# Altium schematic sheet sheet_display.SchDoc
size A4
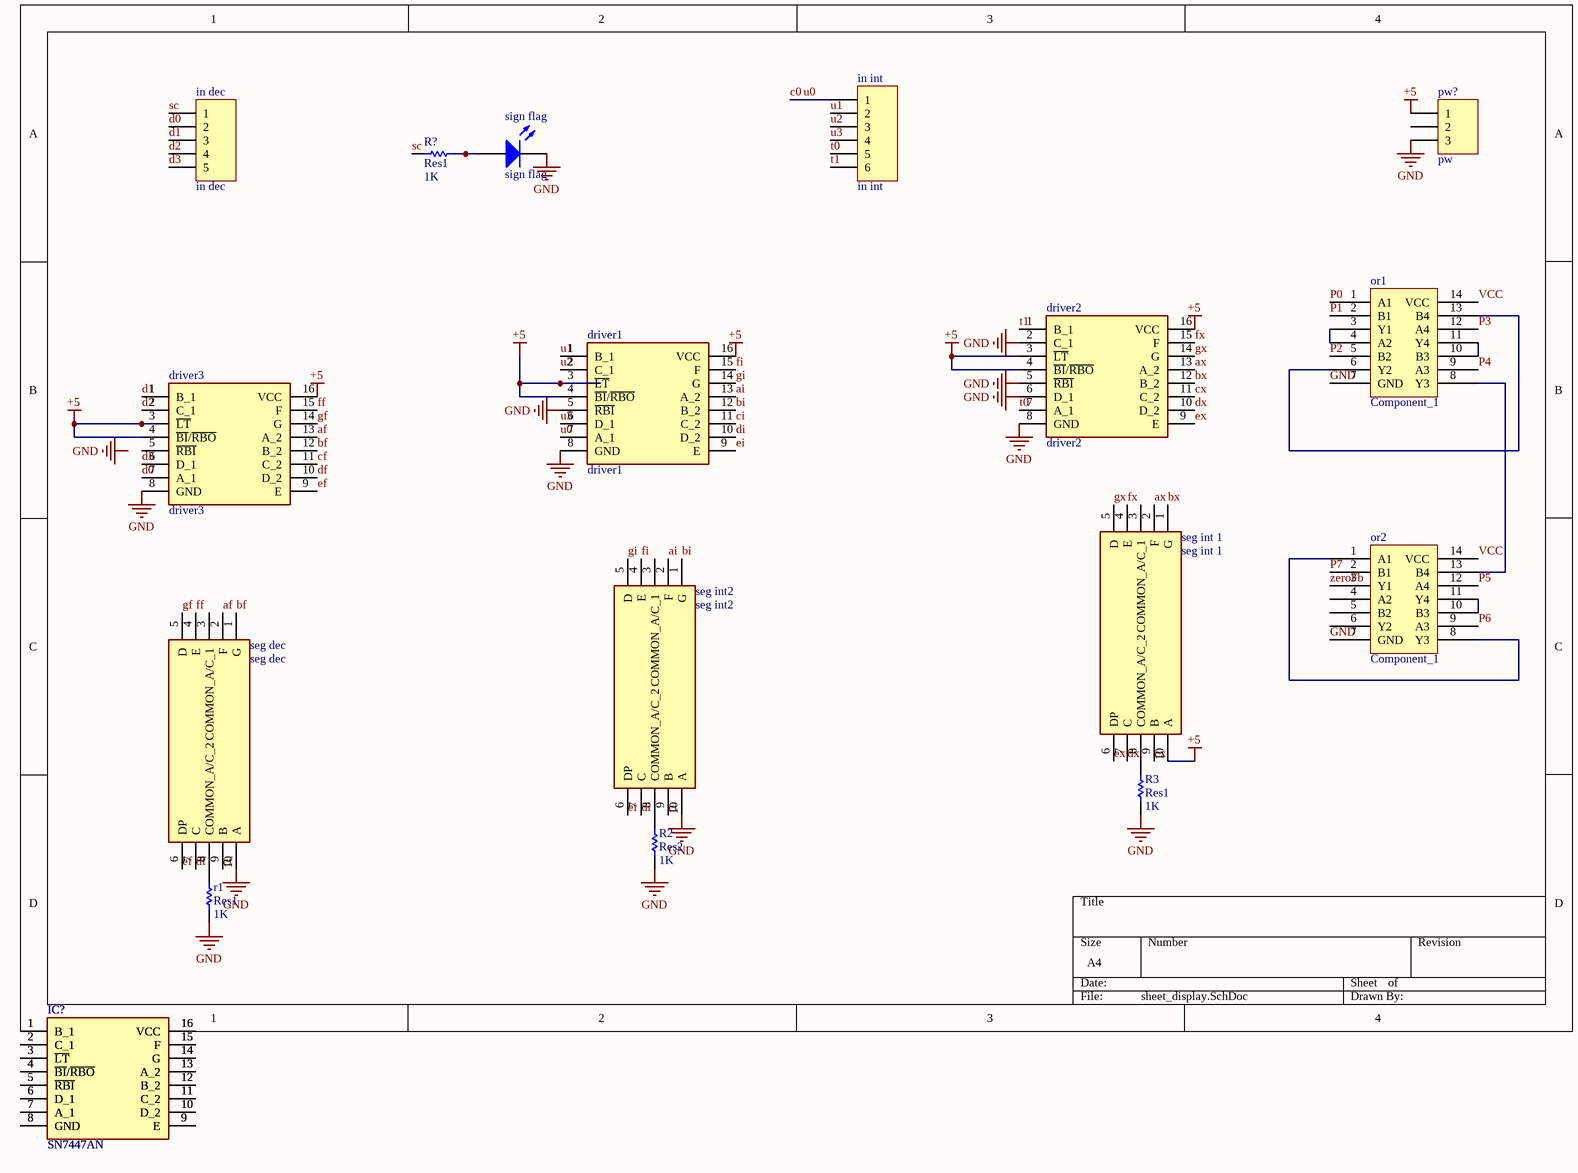
[diagram p0: sheet_display.SchDoc]

## Parts
(Parts that share a designator on the sheet are numbered #1, #2 ... from top to bottom, then left to right.)
driver1  driver1  [Model Name]
driver2  driver2  [DIP762W66P254L2134H508Q16N]
driver3  driver3  [DIP762W66P254L2134H508Q16N]
IC?#1  SN7447AN  [DIP762W66P254L2134H508Q16N]
IC?#2  SN7447AN  [DIP762W66P254L2134H508Q16N]
IC?#3  SN7447AN  [DIP762W66P254L2134H508Q16N]
in_dec  in dec  [HDR1X5]
in_int  in int  [HDR1X6]
or1  Component_1  [PCBComponent_1]
or2  Component_1  [PCBComponent_1]
pw?  pw  [HDR1X3]
r1  Res1  value 1K  [AXIAL-0.3]
R2  Res2  value 1K  [AXIAL-0.3]
R3  Res1  value 1K  [AXIAL-0.3]
R?  Res1  value 1K  [AXIAL-0.3]
seg_dec  seg dec  [DIPS762W60P254L1280H725Q10N]
seg_int2  seg int2  [DIPS762W60P254L1280H725Q10N]
seg_int_1  seg int 1  [DIPS762W60P254L1280H725Q10N]
sign_flag  sign flag  [3.2X1.6X1.1]

## Nets
+5: driver1.3(~{LT}) driver1.4(~{BI}/~{RBO}) driver1.16(VCC) driver2.3(~{LT}) driver2.4(~{BI}/~{RBO}) driver2.16(VCC) driver3.3(~{LT}) driver3.4(~{BI}/~{RBO}) driver3.16(VCC) pw?.1 seg_int_1.10(A)
GND: driver1.5(~{RBI}) driver1.8(GND) driver2.2(C_1) driver2.5(~{RBI}) driver2.6(D_1) driver2.8(GND) driver3.8(GND) or1.7(GND) or2.7(GND) pw?.3 r1.1 R2.1 R3.1 seg_dec.10(A) seg_int2.10(A) sign_flag.2(K)
af: driver3.13(A_2) seg_dec.2(F)
ai: driver1.13(A_2) seg_int2.2(F)
ax: driver2.13(A_2) seg_int_1.2(F)
bf: driver3.12(B_2) seg_dec.1(G)
bi: driver1.12(B_2) seg_int2.1(G)
bx: driver2.12(B_2) seg_int_1.1(G)
c0: driver1.7(A_1) in_int.1  [also labelled u0]
cf: driver3.11(C_2) seg_dec.9(B)
ci: driver1.11(C_2) seg_int2.9(B)
cx: driver2.11(C_2) seg_int_1.9(B)
d0: driver3.7(A_1) in_dec.2
d1: driver3.1(B_1) in_dec.3
d2: driver3.2(C_1) in_dec.4
d3: driver3.6(D_1) in_dec.5
df: driver3.10(D_2) seg_dec.7(C)
di: driver1.10(D_2) seg_int2.7(C)
dx: driver2.10(D_2) seg_int_1.7(C)
ef: driver3.9(E) seg_dec.6(DP)
ei: driver1.9(E) seg_int2.6(DP)
ex: driver2.9(E) seg_int_1.6(DP)
ff: driver3.15(F) seg_dec.4(E)
fi: driver1.15(F) seg_int2.4(E)
fx: driver2.15(F) seg_int_1.4(E)
gf: driver3.14(G) seg_dec.5(D)
gi: driver1.14(G) seg_int2.5(D)
gx: driver2.14(G) seg_int_1.5(D)
P0: or1.1(A1)
P1: or1.2(B1)
P2: or1.5(B2)
P3: or1.12(A4)
P4: or1.9(A3)
P5: or2.12(A4)
P6: or2.9(A3)
P7: or2.2(B1)
sc: in_dec.1 R?.2
t0: driver2.7(A_1) in_int.5
t1: driver2.1(B_1) in_int.6
u1: driver1.1(B_1) in_int.2
u2: driver1.2(C_1) in_int.3
u3: driver1.6(D_1) in_int.4
VCC: or1.14(VCC) or2.14(VCC)
zeroFb: or2.3(Y1)
NetIC?#1_1: IC?#1.1(B_1) IC?#2.1(B_1) IC?#3.1(B_1)
NetIC?#1_2: IC?#1.2(C_1) IC?#2.2(C_1) IC?#3.2(C_1)
NetIC?#1_3: IC?#1.3(~{LT}) IC?#2.3(~{LT}) IC?#3.3(~{LT})
NetIC?#1_4: IC?#1.4(~{BI}/~{RBO}) IC?#2.4(~{BI}/~{RBO}) IC?#3.4(~{BI}/~{RBO})
NetIC?#1_5: IC?#1.5(~{RBI}) IC?#2.5(~{RBI}) IC?#3.5(~{RBI})
NetIC?#1_6: IC?#1.6(D_1) IC?#2.6(D_1) IC?#3.6(D_1)
NetIC?#1_7: IC?#1.7(A_1) IC?#2.7(A_1) IC?#3.7(A_1)
NetIC?#1_8: IC?#1.8(GND) IC?#2.8(GND) IC?#3.8(GND)
NetIC?#1_9: IC?#1.9(E) IC?#2.9(E) IC?#3.9(E)
NetIC?#1_10: IC?#1.10(D_2) IC?#2.10(D_2) IC?#3.10(D_2)
NetIC?#1_11: IC?#1.11(C_2) IC?#2.11(C_2) IC?#3.11(C_2)
NetIC?#1_12: IC?#1.12(B_2) IC?#2.12(B_2) IC?#3.12(B_2)
NetIC?#1_13: IC?#1.13(A_2) IC?#2.13(A_2) IC?#3.13(A_2)
NetIC?#1_14: IC?#1.14(G) IC?#2.14(G) IC?#3.14(G)
NetIC?#1_15: IC?#1.15(F) IC?#2.15(F) IC?#3.15(F)
NetIC?#1_16: IC?#1.16(VCC) IC?#2.16(VCC) IC?#3.16(VCC)
Netor1_3: or1.3(Y1) or1.4(A2)
Netor1_6: or1.6(Y2) or1.13(B4)
Netor1_8: or1.8(Y3) or2.13(B4)
Netor1_10: or1.10(B3) or1.11(Y4)
Netor2_1: or2.1(A1) or2.8(Y3)
Netor2_10: or2.10(B3) or2.11(Y4)
Netr1_2: r1.2 seg_dec.8(COMMON_A/C_2)
NetR2_2: R2.2 seg_int2.8(COMMON_A/C_2)
NetR3_2: R3.2 seg_int_1.8(COMMON_A/C_2)
NetR?_1: R?.1 sign_flag.1(A)

Not connected (* = marked no-connect by the designer): driver3 5(~{RBI}); or2 4(A2) 5(B2) 6(Y2); pw? 2; seg_dec 3(COMMON_A/C_1); seg_int2 3(COMMON_A/C_1); seg_int_1 3(COMMON_A/C_1)

## Notes on the sheet
- Labels drawn without touching a wire or pin: GND

## Library data of the parts
driver1-driver3 IC?#1-IC?#3 = SN7447AN: Integrated Circuit; Manufacturer_Name: Texas Instruments; Datasheet Link: https://componentsearchengine.com/Datasheets/2/SN7447AN.pdf; Height: 5.08mm; Manufacturer_Part_Number: SN7447AN; Mouser Part Number: 595-SN7447AN; Mouser Price/Stock: https://www.mouser.com/Search/Refine.aspx?Keyword=595-SN7447AN; RS Part Number: 0305406P; RS Price/Stock: http://uk.rs-online.com/web/p/products/0305406P
in_dec = Header 5: Header, 5-Pin; LatestRevisionDate: 17-Jul-2002; LatestRevisionNote: Re-released for DXP Platform.; Publisher: Altium Limited
in_int = Header 6: Header, 6-Pin; LatestRevisionDate: 17-Jul-2002; LatestRevisionNote: Re-released for DXP Platform.; Publisher: Altium Limited
pw? = Header 3: Header, 3-Pin; LatestRevisionDate: 17-Jul-2002; LatestRevisionNote: Re-released for DXP Platform.; Publisher: Altium Limited
r1 R2 R3 R? = Res1: Resistor; Published: 8-Jun-2000; LatestRevisionDate: 17-Jul-2002; LatestRevisionNote: Re-released for DXP Platform.; PackageReference: AXIAL-0.3; Publisher: Altium Limited; PackageDescription: Axial Device, Thru-Hole; 2 Leads; 0.3 in Pin Spacing
seg_dec = HDSP-301E: Manufacturer_Name: Avago Technologies; Datasheet Link: https://docs.broadcom.com/docs/AV02-0625EN; Height: 7.25mm; Manufacturer_Part_Number: HDSP-301E; Mouser Part Number: 630-HDSP-301E; Mouser Price/Stock: https://www.mouser.com/Search/Refine.aspx?Keyword=630-HDSP-301E
seg_int2 seg_int_1 = HDSP-301E: seg dec; Manufacturer_Name: Avago Technologies; Datasheet Link: https://docs.broadcom.com/docs/AV02-0625EN; Height: 7.25mm; Manufacturer_Part_Number: HDSP-301E; Mouser Part Number: 630-HDSP-301E; Mouser Price/Stock: https://www.mouser.com/Search/Refine.aspx?Keyword=630-HDSP-301E
sign_flag = LED2: Typical RED, GREEN, YELLOW, AMBER GaAs LED; Published: 8-Jun-2000; LatestRevisionDate: 17-Jul-2002; LatestRevisionNote: Re-released for DXP Platform.; PackageVersion: Feb-2002; PackageReference: 3.2X1.6X1.1; Publisher: Altium Limited; PackageDescription: SM LED; 2 Flat Leads